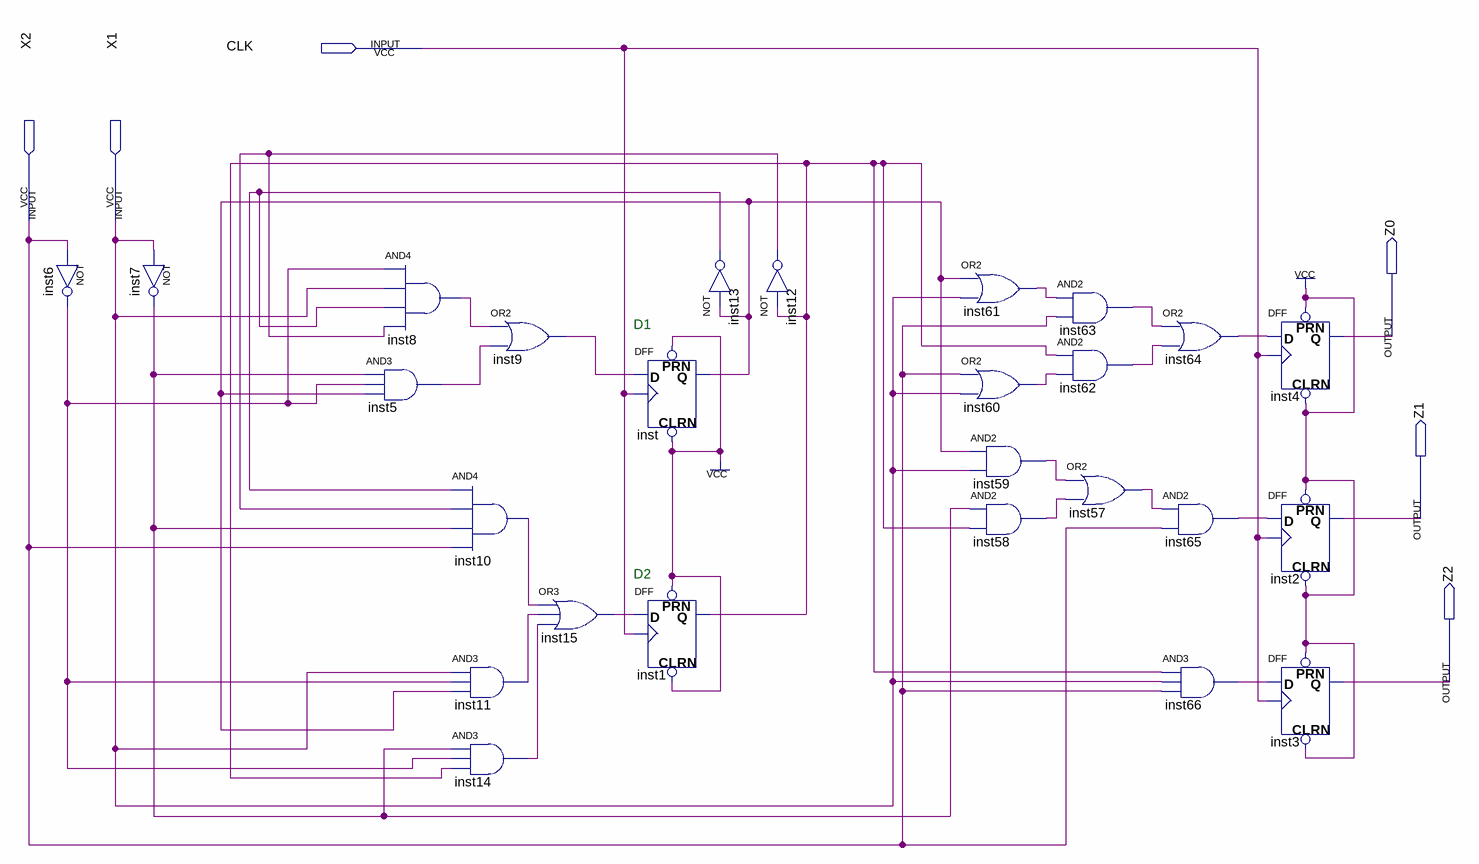
[diagram p0: schematic sheet]
// Quartus schematic p11.bdf as structural Verilog: 26 symbols, 6 pins
module p11 (
  input  CLK,
  input  X2,
  input  X1,
  output Z0,
  output Z1,
  output Z2
);

  wire inst1_q, inst5_out, inst6_out, inst7_out, inst8_out, inst9_out, inst10_out, inst11_out, inst12_out,
       inst13_out, inst14_out, inst15_out, inst57_out, inst58_out, inst59_out, inst60_out, inst61_out,
       inst62_out, inst63_out, inst64_out, inst65_out, inst66_out, inst_q;

  not inst6 (inst6_out, X2);
  not inst7 (inst7_out, X1);
  and inst8 (inst8_out, inst6_out, X1, inst13_out, inst12_out);
  and inst5 (inst5_out, inst7_out, inst6_out, inst_q);
  or inst9 (inst9_out, inst8_out, inst5_out);
  and inst10 (inst10_out, inst13_out, inst12_out, inst7_out, X2);
  and inst11 (inst11_out, X1, inst6_out, inst_q);
  and inst14 (inst14_out, inst7_out, inst6_out, inst1_q);
  or inst15 (inst15_out, inst10_out, inst11_out, inst14_out);
  DFF inst (.CLRN(1'b1), .CLK(CLK), .D(inst9_out), .PRN(1'b1), .Q(inst_q));
  DFF inst1 (.CLRN(1'b1), .CLK(CLK), .D(inst15_out), .PRN(1'b1), .Q(inst1_q));
  not inst13 (inst13_out, inst_q);
  not inst12 (inst12_out, inst1_q);
  or inst61 (inst61_out, inst_q, X1);
  or inst60 (inst60_out, X2, X1);
  and inst59 (inst59_out, inst_q, X1);
  and inst58 (inst58_out, inst7_out, inst1_q);
  and inst63 (inst63_out, inst61_out, X2);
  and inst62 (inst62_out, inst1_q, inst60_out);
  or inst57 (inst57_out, inst59_out, inst58_out);
  or inst64 (inst64_out, inst63_out, inst62_out);
  and inst65 (inst65_out, inst57_out, X2);
  and inst66 (inst66_out, inst1_q, X1, X2);
  DFF inst4 (.CLRN(1'b1), .CLK(CLK), .D(inst64_out), .PRN(1'b1), .Q(Z0));
  DFF inst2 (.CLRN(1'b1), .CLK(CLK), .D(inst65_out), .PRN(1'b1), .Q(Z1));
  DFF inst3 (.CLRN(1'b1), .CLK(CLK), .D(inst66_out), .PRN(1'b1), .Q(Z2));

  // Notes on the sheet:
  //   D1
  //   D2
endmodule
